# Altium schematic sheet [07] - DOC REVISION HISTORY.SchDoc
size A3; DocumentNumber: 7; SheetNumber: 7; SheetTotal: 8; NameAuthor: Angle Vu
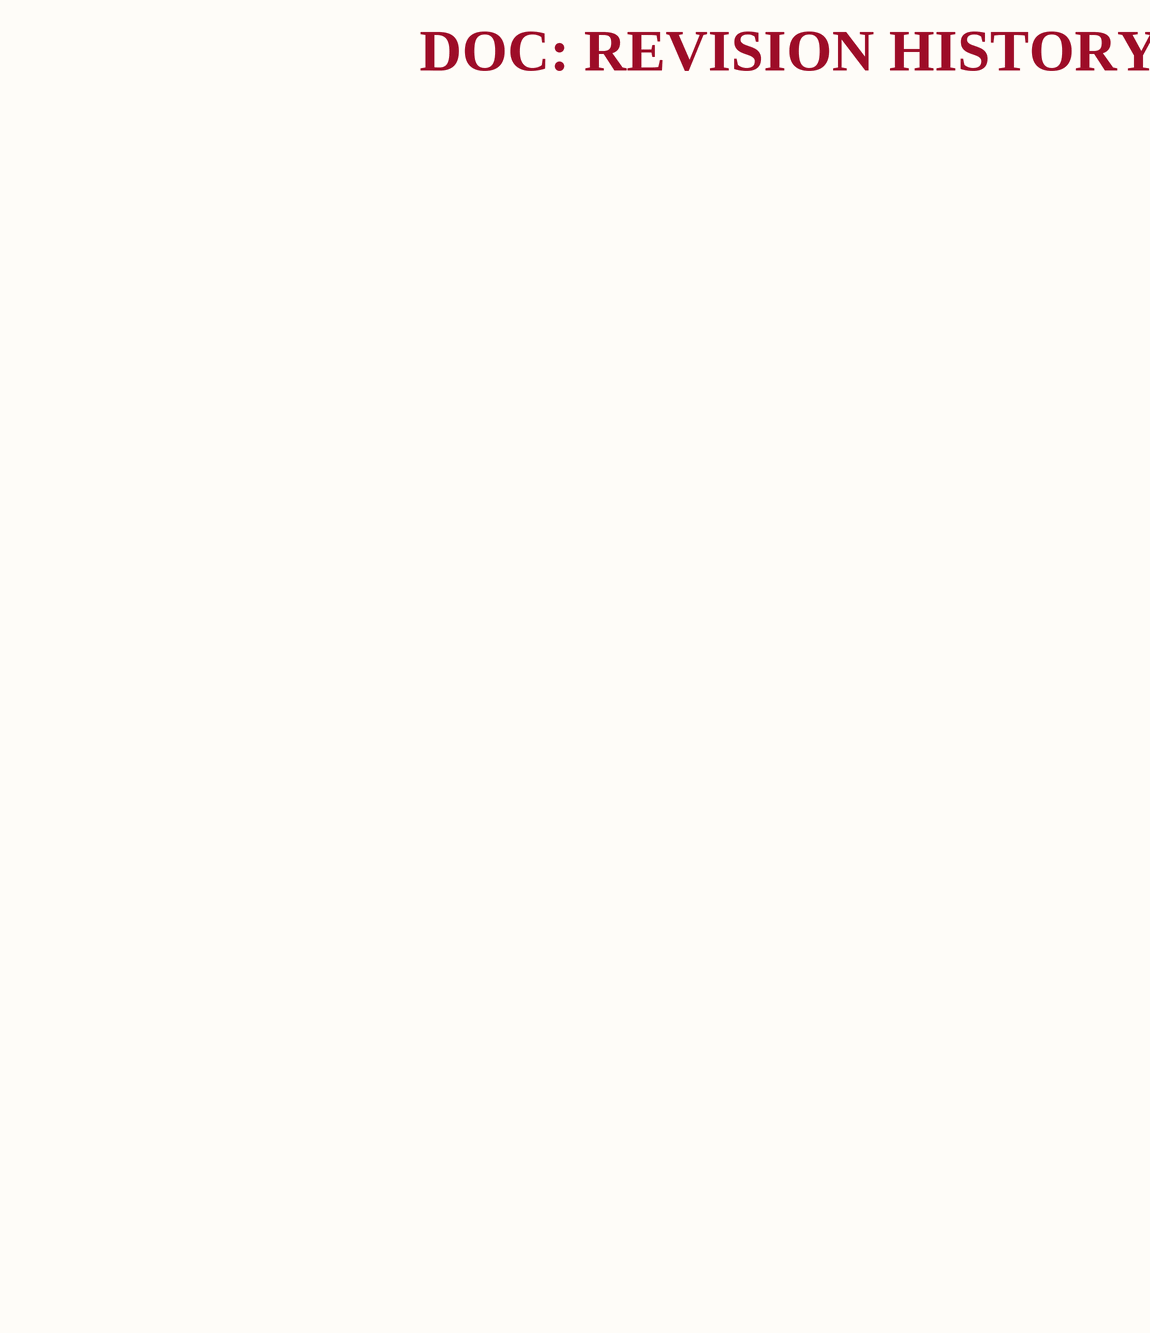
[diagram p0: [07] - DOC REVISION HISTORY.SchDoc]

## Notes on the sheet
- DOC: REVISION HISTORY
- CLOCKS (CPU & PCIE)
- Designed By
- Checked By
- Company:
- Size:
- A3
- Address:
- Sheet:
- /